# Altium schematic sheet SolidStateRadiationChannel.SchDoc
size A3; Author: Ali Zoubir; Organization: ETML-ES; Address1: Avenue Recordon 1; Address2: 1004 Lausanne; Address3: Switzerland; Revision: 1924B; SheetNumber: 3; SheetTotal: 4; Version: V0
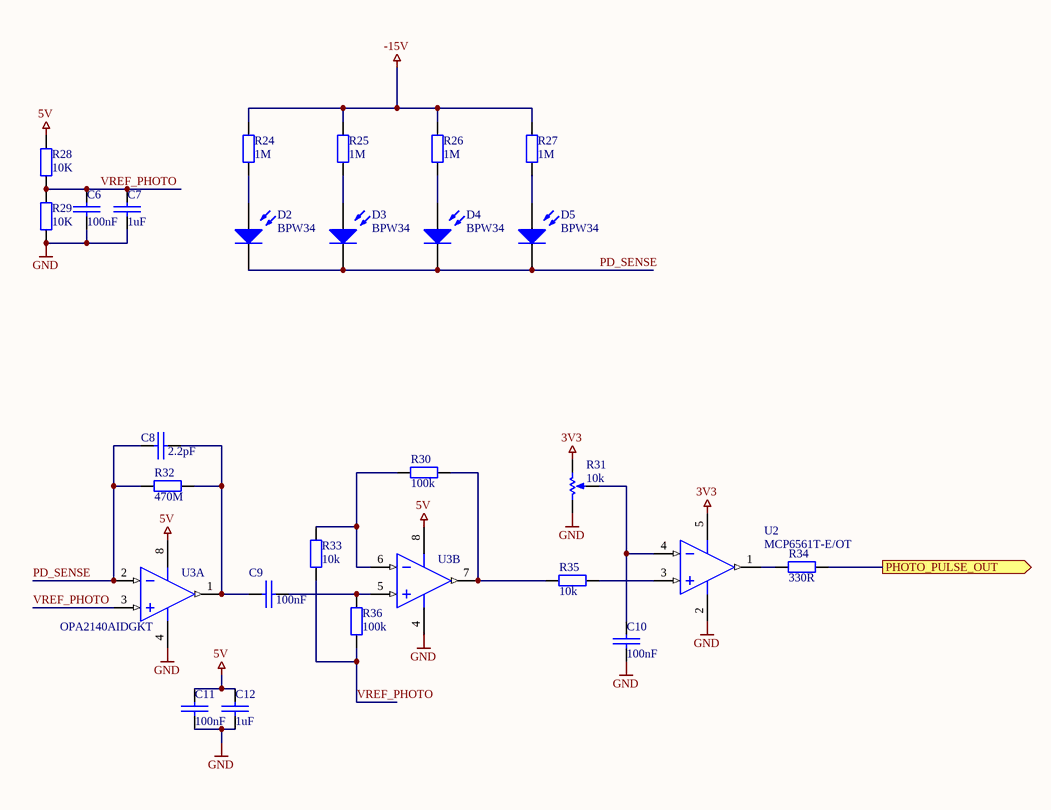
[diagram p0: SolidStateRadiationChannel.SchDoc]

## Parts
C6  100nF  [Cap_0805]
C7  1uF  [Cap_0805]
C8  2.2pF  [Cap_0805]
C9  100nF  [Cap_0805]
C10  100nF  [Cap_0805]
C11  100nF  [Cap_0805]
C12  1uF  [Cap_0805]
D2  BPW34  [BPW34]
D3  BPW34  [BPW34]
D4  BPW34  [BPW34]
D5  BPW34  [BPW34]
R24  1M  [RES_0805]
R25  1M  [RES_0805]
R26  1M  [RES_0805]
R27  1M  [RES_0805]
R28  10K  [RES_0805]
R29  10K  [RES_0805]
R30  100k  [RES_0805]
R31  10k  [VR5]
R32  470M  [RES_0805]
R33  10k  [RES_0805]
R34  330R  [RES_0805]
R35  10k  [RES_0805]
R36  100k  [RES_0805]
U2  MCP6561T-E/OT  [SOT-23-OT5_L]
U3  OPA2140AIDGKT  [DGK0008A_N]  (parts A,B of 2)

## Ports
PHOTO_PULSE_OUT (out)

## Nets
3V3: R31.1(TOP) U2.5(VDD)
5V: C11.1 C12.1 R28.1 U3.8(V+)
-15V: R24.1 R25.1 R26.1 R27.1
GND: C6.2 C7.2 C10.1 C11.2 C12.2 R29.2 R31.2(BOT) U2.2(VSS) U3.4(V-)
PD_SENSE: C8.1 D2.2(K) D3.2(K) D4.2(K) D5.2(K) R32.1 U3.2(IN_A-)
PHOTO_PULSE_OUT: R34.2 ; port PHOTO_PULSE_OUT
VREF_PHOTO: C6.1 C7.1 R28.2 R29.1 R33.2 R36.2 U3.3(IN_A+)
NetC8_2: C8.2 C9.1 R32.2 U3.1(OUT_A)
NetC9_2: C9.2 R36.1 U3.5(IN_B+)
NetC10_2: C10.2 R31.3(TAP) U2.4(IN-)
NetD2_1: D2.1(A) R24.2
NetD3_1: D3.1(A) R25.2
NetD4_1: D4.1(A) R26.2
NetD5_1: D5.1(A) R27.2
NetR30_1: R30.1 R33.1 U3.6(IN_B-)
NetR30_2: R30.2 R35.1 U3.7(OUT_B)
NetR34_1: R34.1 U2.1(OUT)
NetR35_2: R35.2 U2.3(IN+)

## Notes on the sheet
- Fichier :
- a
- Date :
- Heure :
- Version :
- Auteur :
- Modif.
- b
- c
- d
- Projet :
- No :
- Nb feuilles
- Feuille n°
- Chemin :

## Library data of the parts
C6-C12 = C: SDTSourceLibName: C:\WINDOWS\TEMP\DA.LIB; PCB Footprint: RC0805
D2-D5 = BPW34: Silicon PIN Photodiode
R24-R30 R32-R36 = CMP-2001-00528-1: Res 0805; Part Number: ERJ6ENF2703V; Manufacturer: Panasonic
R31 = RPot: Potentiometer; Sim Note: Enter the Resistance value and the set point into parameter fields.; Set Position: 0.5; Published: 8-Jun-2000; LatestRevisionDate: 17-Jul-2002; LatestRevisionNote: Re-released for DXP Platform.; PackageReference: VR5; Publisher: Altium Limited; PackageDescription: Variable Resistor, Thru-Hole; 3 Leads; Value: 10k
U2 = CMP-0187-00042-3: None; Input Bias Current: 1pA; Hysteresis: 5mV; Output Type: TTL; Propagation Delay: 80ns; Output Current per Channel: 25mA; Max Supply Voltage: 5.5V; Power Supply Rejection Ratio (PSRR): 70dB; Response Time: 49ns; Nominal Supply Current: 130uA; Common Mode Rejection Ratio: 66dB; Natural Thermal Resistance: 256°C/W; Number of Elements: 1; Input Offset Voltage (Vos): 10mV; Output Current: 50mA; Min Supply Voltage: 1.8V; Case/Package: SOT-23; Packaging: Tape and Reel; Radiation Hardening: No; Width: 1.8mm; RoHS Compliant: Yes; Package Quantity: 3000; Min Operating Temperature: -40°C; Lead Free: Lead Free; Technology: CMOS; Max Operating Temperature: 125°C; Mount: Surface Mount; REACH SVHC: No SVHC; Max Supply Current: 130uA; Length: 3.1mm; Type: General Purpose; Number of Pins: 5; Contact Plating: Tin; Number of Channels: 1; Height: 1.3mm; Quiescent Current: 130uA; Max Input Current: 1pA; Supply Current: 130uA; Turn-On Delay Time: 49ns
U3 = CMP-0272-01237-3: 11 MHz, Precision, Low Noise, Rail-to-Rail Output, JFET Operational Amplifier, 4.5 to 36 V, -40 to 125 degC, 8-pin SOP (DGK8), Green (RoHS & no Sb/Br); Manufacturer: Texas Instruments; Offset Drift(Typ)(uV/C): 0.35; Rating: Catalog; GBW(Typ)(MHz): 11; Total Supply Voltage(Min)(+5V is 5, +/-5V is 10): 4.5; Slew Rate(Typ)(V/us): 20; Vio (25C)(Max)(mV): 0.12; Total Supply Voltage(Max)(+5V is 5, +/-5V is 10): 36; CMRR(Min)(dB): 126; Iq per channel(Max)(mA): 2; Packing: SMALL T&R; Sub Family: High Supply Voltage Amplifier (>=30V), Low Input Bias Current Amp (<=10pA), Low Noise Amp (<=10nV/rtHz), Low Offset Voltage Amplifier (<=500uV), Precision Amplifier; IIB(Max)(pA): 10; ComponentLink2URL: http://www.ti.com/lit/ds/symlink/opa2140.pdf; Eco-Plan: Green (RoHS & no Sb/Br); ComponentLink1Description: Manufacturer URL; ComponentLink2Description: Datasheet; Code_JEDEC: MO-187; ComponentLink3Description: Package Specification; PackageReference: DGK0008A; PartNumber: OPA2140AIDGKT; ComponentLink3URL: http://www.ti.com/litv/pdf/mpds028d; PackageDescription: 8-Pin Thin Small Outline, Body 3 x 3 mm, Pitch 0.65 mm; PackageVersion: 4073329/E, 05/2006; DatasheetVersion: SBOS498A; Number of Channels: 2; ComponentLink1URL: http://www.ti.com/; Mounting Technology: Surface Mount